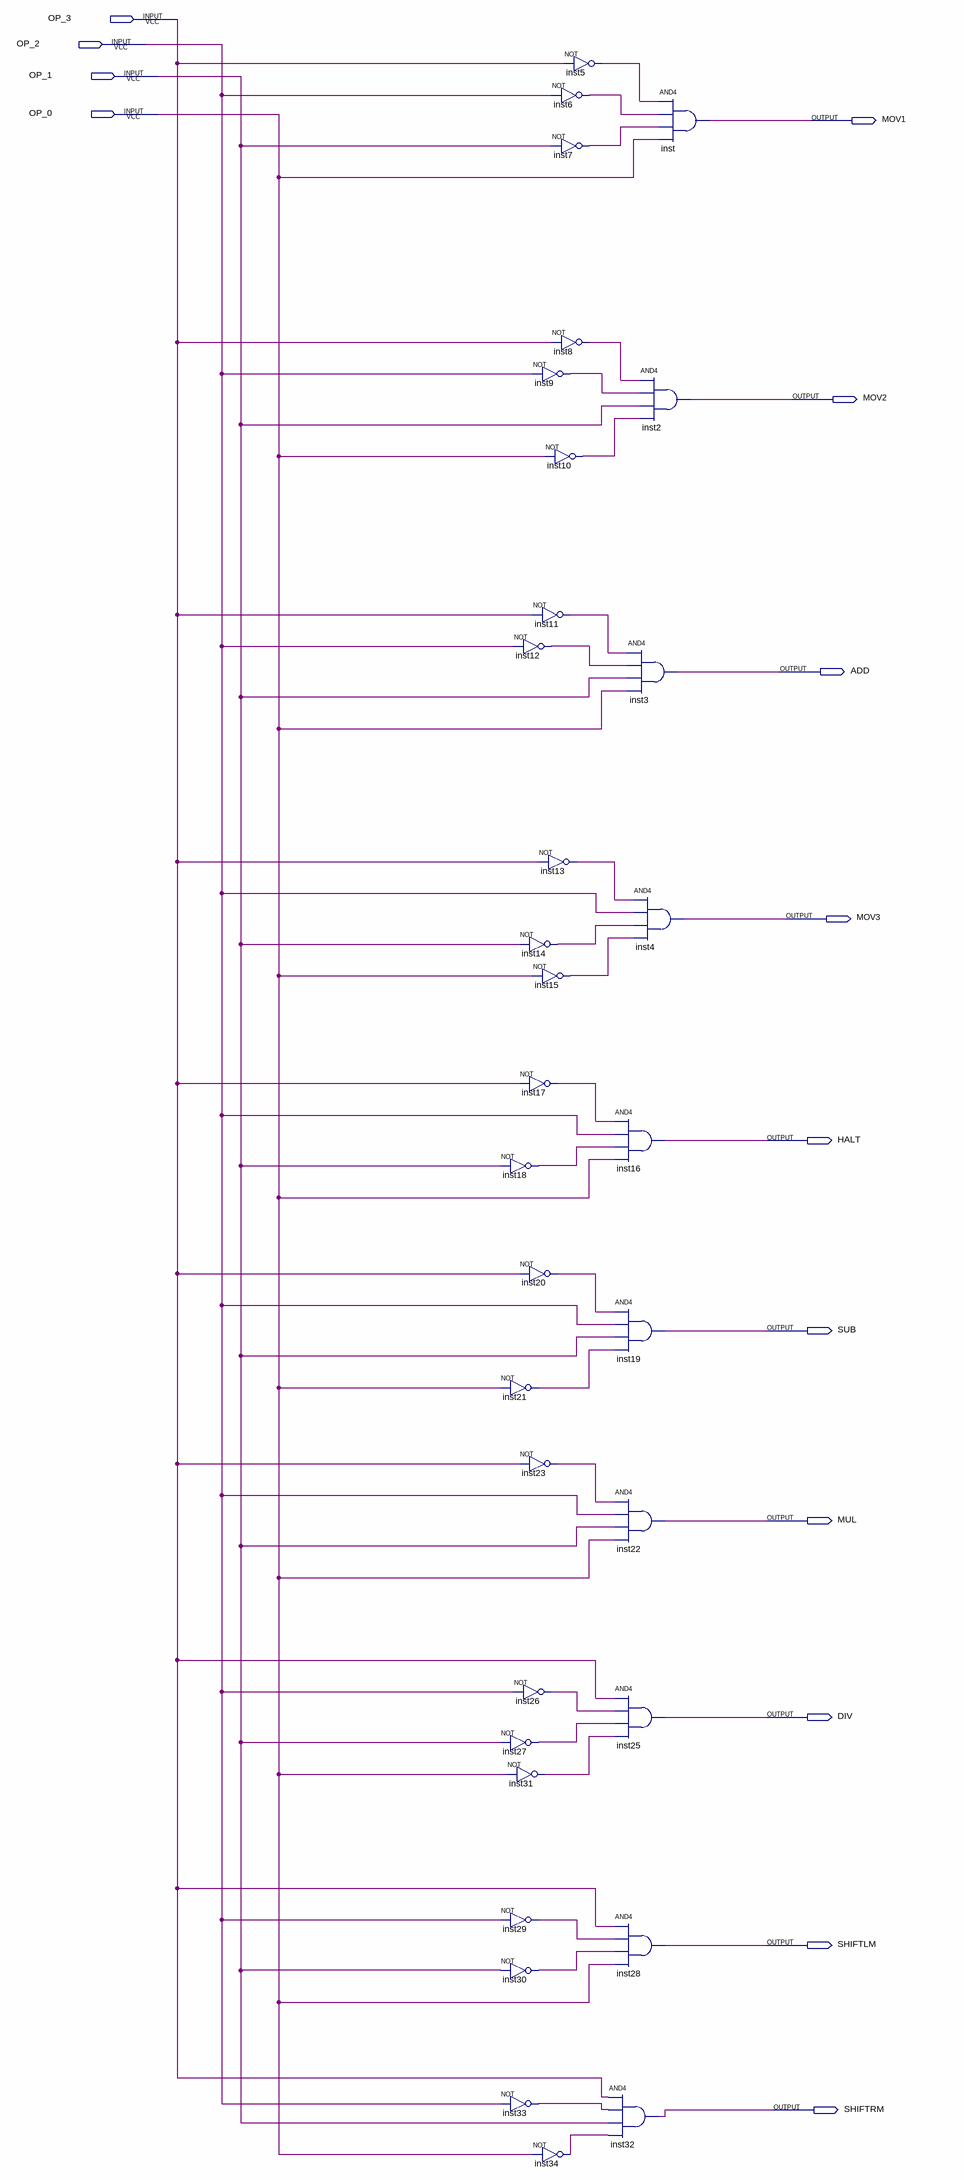
[diagram p0: schematic sheet]
// Quartus schematic IR_encoder.bdf as structural Verilog: 33 symbols, 14 pins
module IR_encoder (
  input  OP_3,
  input  OP_2,
  input  OP_1,
  input  OP_0,
  output MOV1,
  output MOV2,
  output ADD,
  output MOV3,
  output HALT,
  output SUB,
  output MUL,
  output DIV,
  output SHIFTLM,
  output SHIFTRM
);

  wire inst5_out, inst6_out, inst7_out, inst8_out, inst9_out, inst10_out, inst11_out, inst12_out, inst13_out,
       inst14_out, inst15_out, inst17_out, inst18_out, inst20_out, inst21_out, inst23_out, inst26_out,
       inst27_out, inst29_out, inst30_out, inst31_out, inst33_out, inst34_out;

  not inst18 (inst18_out, OP_1);
  not inst21 (inst21_out, OP_0);
  not inst27 (inst27_out, OP_1);
  not inst31 (inst31_out, OP_0);
  not inst29 (inst29_out, OP_2);
  not inst30 (inst30_out, OP_1);
  not inst33 (inst33_out, OP_2);
  not inst6 (inst6_out, OP_2);
  not inst7 (inst7_out, OP_1);
  not inst8 (inst8_out, OP_3);
  not inst9 (inst9_out, OP_2);
  not inst10 (inst10_out, OP_0);
  not inst11 (inst11_out, OP_3);
  not inst12 (inst12_out, OP_2);
  not inst13 (inst13_out, OP_3);
  not inst14 (inst14_out, OP_1);
  not inst15 (inst15_out, OP_0);
  not inst17 (inst17_out, OP_3);
  not inst20 (inst20_out, OP_3);
  not inst23 (inst23_out, OP_3);
  not inst26 (inst26_out, OP_2);
  not inst34 (inst34_out, OP_0);
  not inst5 (inst5_out, OP_3);
  and inst32 (SHIFTRM, OP_3, inst33_out, OP_1, inst34_out);
  and inst (MOV1, inst5_out, inst6_out, inst7_out, OP_0);
  and inst2 (MOV2, inst8_out, inst9_out, OP_1, inst10_out);
  and inst3 (ADD, inst11_out, inst12_out, OP_1, OP_0);
  and inst4 (MOV3, inst13_out, OP_2, inst14_out, inst15_out);
  and inst16 (HALT, inst17_out, OP_2, inst18_out, OP_0);
  and inst19 (SUB, inst20_out, OP_2, OP_1, inst21_out);
  and inst22 (MUL, inst23_out, OP_2, OP_1, OP_0);
  and inst25 (DIV, OP_3, inst26_out, inst27_out, inst31_out);
  and inst28 (SHIFTLM, OP_3, inst29_out, inst30_out, OP_0);
endmodule
